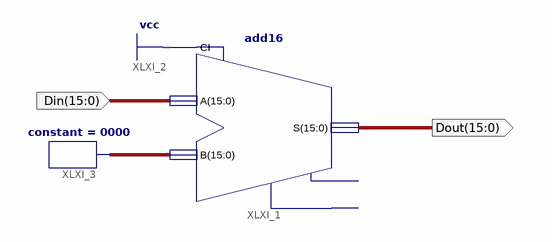
[diagram p0: schematic sheet 1]
// Xilinx ISE schematic inc.sch (spartan3e) as structural Verilog: 2 symbols, 2 ports
module inc (
  input  [15:0] Din,
  output [15:0] Dout
);

  wire [15:0] XLXN_5;

  add16 XLXI_1 (.A(Din), .B(XLXN_5), .CI(1'b1), .S(Dout));  // open: CO, OFL
  constant #(.CValue("0000")) XLXI_3 (.O(XLXN_5));
endmodule
